# EAGLE schematic qec_pcb_v2 (EAGLE 9.0.1)
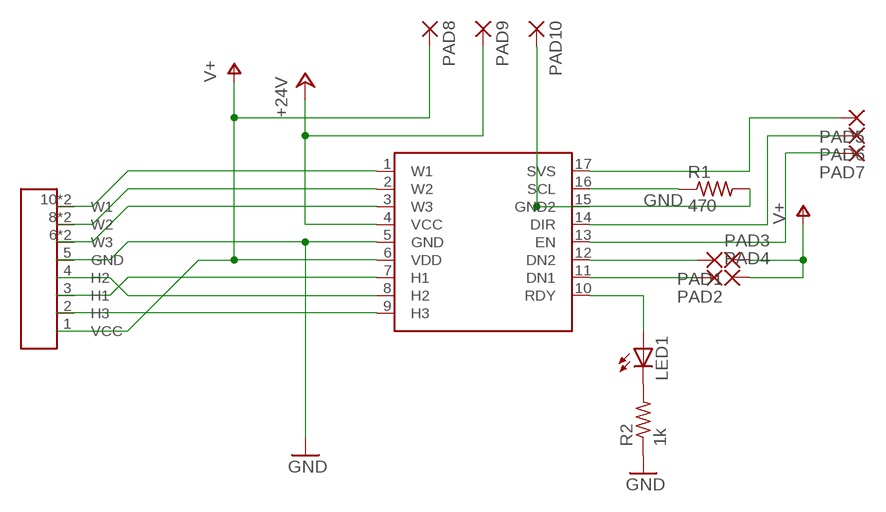
[diagram p0: schematic, sheet 1]

## Parts
K1  68611114122  [68611114122]
LED1  LEDCHIPLED_0805  [CHIPLED_0805]
PAD1  SMD2  [SMD1,27-2,54]
PAD2  SMD2  [SMD1,27-2,54]
PAD3  SMD2  [SMD1,27-2,54]
PAD4  SMD2  [SMD1,27-2,54]
PAD5  SMD2  [SMD1,27-2,54]
PAD6  SMD2  [SMD1,27-2,54]
PAD7  SMD2  [SMD1,27-2,54]
PAD8  SMD5  [SMD2,54-5,08]
PAD9  SMD5  [SMD2,54-5,08]
PAD10  SMD5  [SMD2,54-5,08]
R1  470  R-US_M0805  [M0805]
R2  1k  R-US_M0805  [M0805]
U$1  1-Q-EC1-Q-EC-SMD  [1-Q-EC-SMD]

## Nets
+24V: PAD9.1(P) U$1.4(VCC)
GND: K1.5(GND) PAD10.1(P) R1.2 R2.1 U$1.5(GND) U$1.15(GND2)
N$1: LED1.C R2.2
N$2: LED1.A U$1.10(RDY)
N$3: PAD2.1(P) U$1.11(DN1)
N$4: PAD1.1(P) U$1.12(DN2)
N$5: K1.10(W1) K1.11(W1) U$1.1(W1)
N$6: R1.1 U$1.16(SCL)
N$8: PAD6.1(P) U$1.14(DIR)
N$9: PAD7.1(P) U$1.13(EN)
N$10: PAD5.1(P) U$1.17(SVS)
N$11: K1.8(W2) K1.9(W2) U$1.2(W2)
N$12: K1.6(W3) K1.7(W3) U$1.3(W3)
N$13: K1.3(H1) U$1.7(H1)
N$14: K1.4(H2) U$1.8(H2)
N$16: K1.2(H3) U$1.9(H3)
V+: K1.1(VCC) PAD3.1(P) PAD4.1(P) PAD8.1(P) U$1.6(VDD)

## Library data of the parts
K1 = dedo:68611114122: WR-FPC 1.00mm SMT ZIF Horizontal Top Contact, 11 Pins=>Code : Con_FPC_ZIF_1.00_68611114122 <http://katalog.we-online.de/media/images/eican/Con_FPC_ZIF_1.00_6861xx14122_pf2.jpg> Details see: http://katalog.we-online.de/en/em/686_1xx_141_22 Created 2014-07-09, Karrer Zheng 2014 (C) Würth Elektronik
LED1 = led:LED: LED OSRAM: - CHIPLED LG R971, LG N971, LY N971, LG Q971, LY Q971, LO R971, LY R971 LH N974, LH R974 LS Q976, LO Q976, LY Q976 LO Q996 - Hyper CHIPLED LW Q18S LB Q993, LB Q99A, LB R99A - SideLED LS A670, LO A670, LY A670, LG A670, LP A670 LB A673, LV A673, LT A673, LW A673 LH A674 LY A675 LS A676, LA A676, LO A676, LY A676, LW A676 LS A679, LY A679, LG A679 - Hyper Micro SIDELED® LS Y876, LA Y876, LO Y876, LY Y876 LT Y87S - SmartLED LW L88C, LW L88S LB L89C, LB L89S, LG L890 LS L89K, LO L89K, LY L89K LS L896, LA L896, LO L896, LY L896 - TOPLED LS T670, LO T670, LY T670, LG T670, LP T670 LSG T670, LSP T670, LSY T670, LOP T670, LYG T670 LG T671, LOG T671, LSG T671 LB T673, LV T673, LT T673, LW T673 LH T674 LS T676, LA T676, LO T676, LY T676, LB T676, LH T676, LSB T676, LW T676 LB T67C, LV T67C, LT T67C, LS T67K, LO T67K, LY T67K, LW E67C LS E67B, LA E67B, LO E67B, LY E67B, LB E67C, LV E67C, LT E67C LW T67C LS T679, LY T679, LG T679 LS T770, LO T770, LY T770, LG T770, LP T770 LB T773, LV T773, LT T773, LW T773 LH T774 LS E675, LA E675, LY E675, LS T675 LS T776, LA T776, LO T776, LY T776, LB T776 LHGB T686 LT T68C, LB T68C - Hyper Mini TOPLED® LB M676 - Mini TOPLED Santana® LG M470 LS M47K, LO M47K, LY M47K Source: http://www.osram.convergy.de LUXEON: - LUMILED® LXK2-PW12-R00, LXK2-PW12-S00, LXK2-PW14-U00, LXK2-PW14-V00 LXK2-PM12-R00, LXK2-PM12-S00, LXK2-PM14-U00 LXK2-PE12-Q00, LXK2-PE12-R00, LXK2-PE12-S00, LXK2-PE14-T00, LXK2-PE14-U00 LXK2-PB12-K00, LXK2-PB12-L00, LXK2-PB12-M00, LXK2-PB14-N00, LXK2-PB14-P00, LXK2-PB14-Q00 LXK2-PR12-L00, LXK2-PR12-M00, LXK2-PR14-Q00, LXK2-PR14-R00 LXK2-PD12-Q00, LXK2-PD12-R00, LXK2-PD12-S00 LXK2-PH12-R00, LXK2-PH12-S00 LXK2-PL12-P00, LXK2-PL12-Q00, LXK2-PL12-R00 Source: www.luxeon.com KINGBRIGHT: KA-3528ASYC Source: www.kingbright.com
PAD1-PAD7 = wirepad:SMD2: SMD PAD
PAD8-PAD10 = wirepad:SMD5: SMD PAD
R1 R2 = resistor:R-US_: RESISTOR, American symbol
U$1 = dedo:1-Q-EC